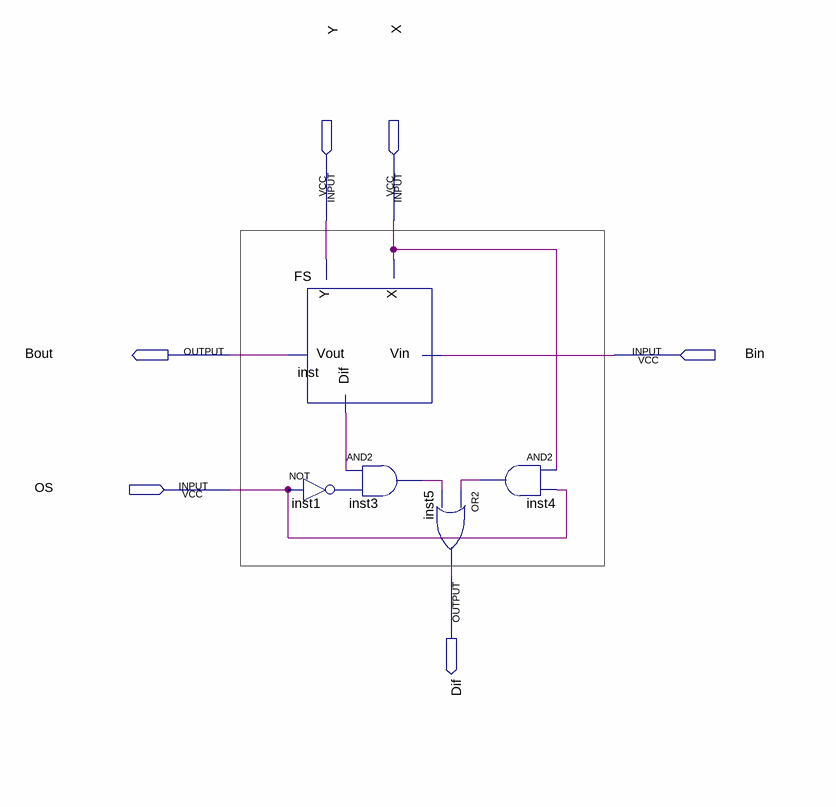
[diagram p0: schematic sheet]
// Quartus schematic CSM.bdf as structural Verilog: 5 symbols, 6 pins
module CSM (
  input  Y,
  input  X,
  input  Bin,
  input  OS,
  output Bout,
  output Dif
);

  wire inst1_out, inst3_out, inst4_out, inst_dif;

  FS inst (.X(X), .Y(Y), .Vin(Bin), .Vout(Bout), .Dif(inst_dif));
  not inst1 (inst1_out, OS);
  and inst3 (inst3_out, inst_dif, inst1_out);
  or inst5 (Dif, inst4_out, inst3_out);
  and inst4 (inst4_out, X, OS);
endmodule
